# EAGLE schematic Flipdot_control (EAGLE 8.4.1)
Flip-dot Segment Controller

## Sheet 1 of 4: Connector and Row Drivers
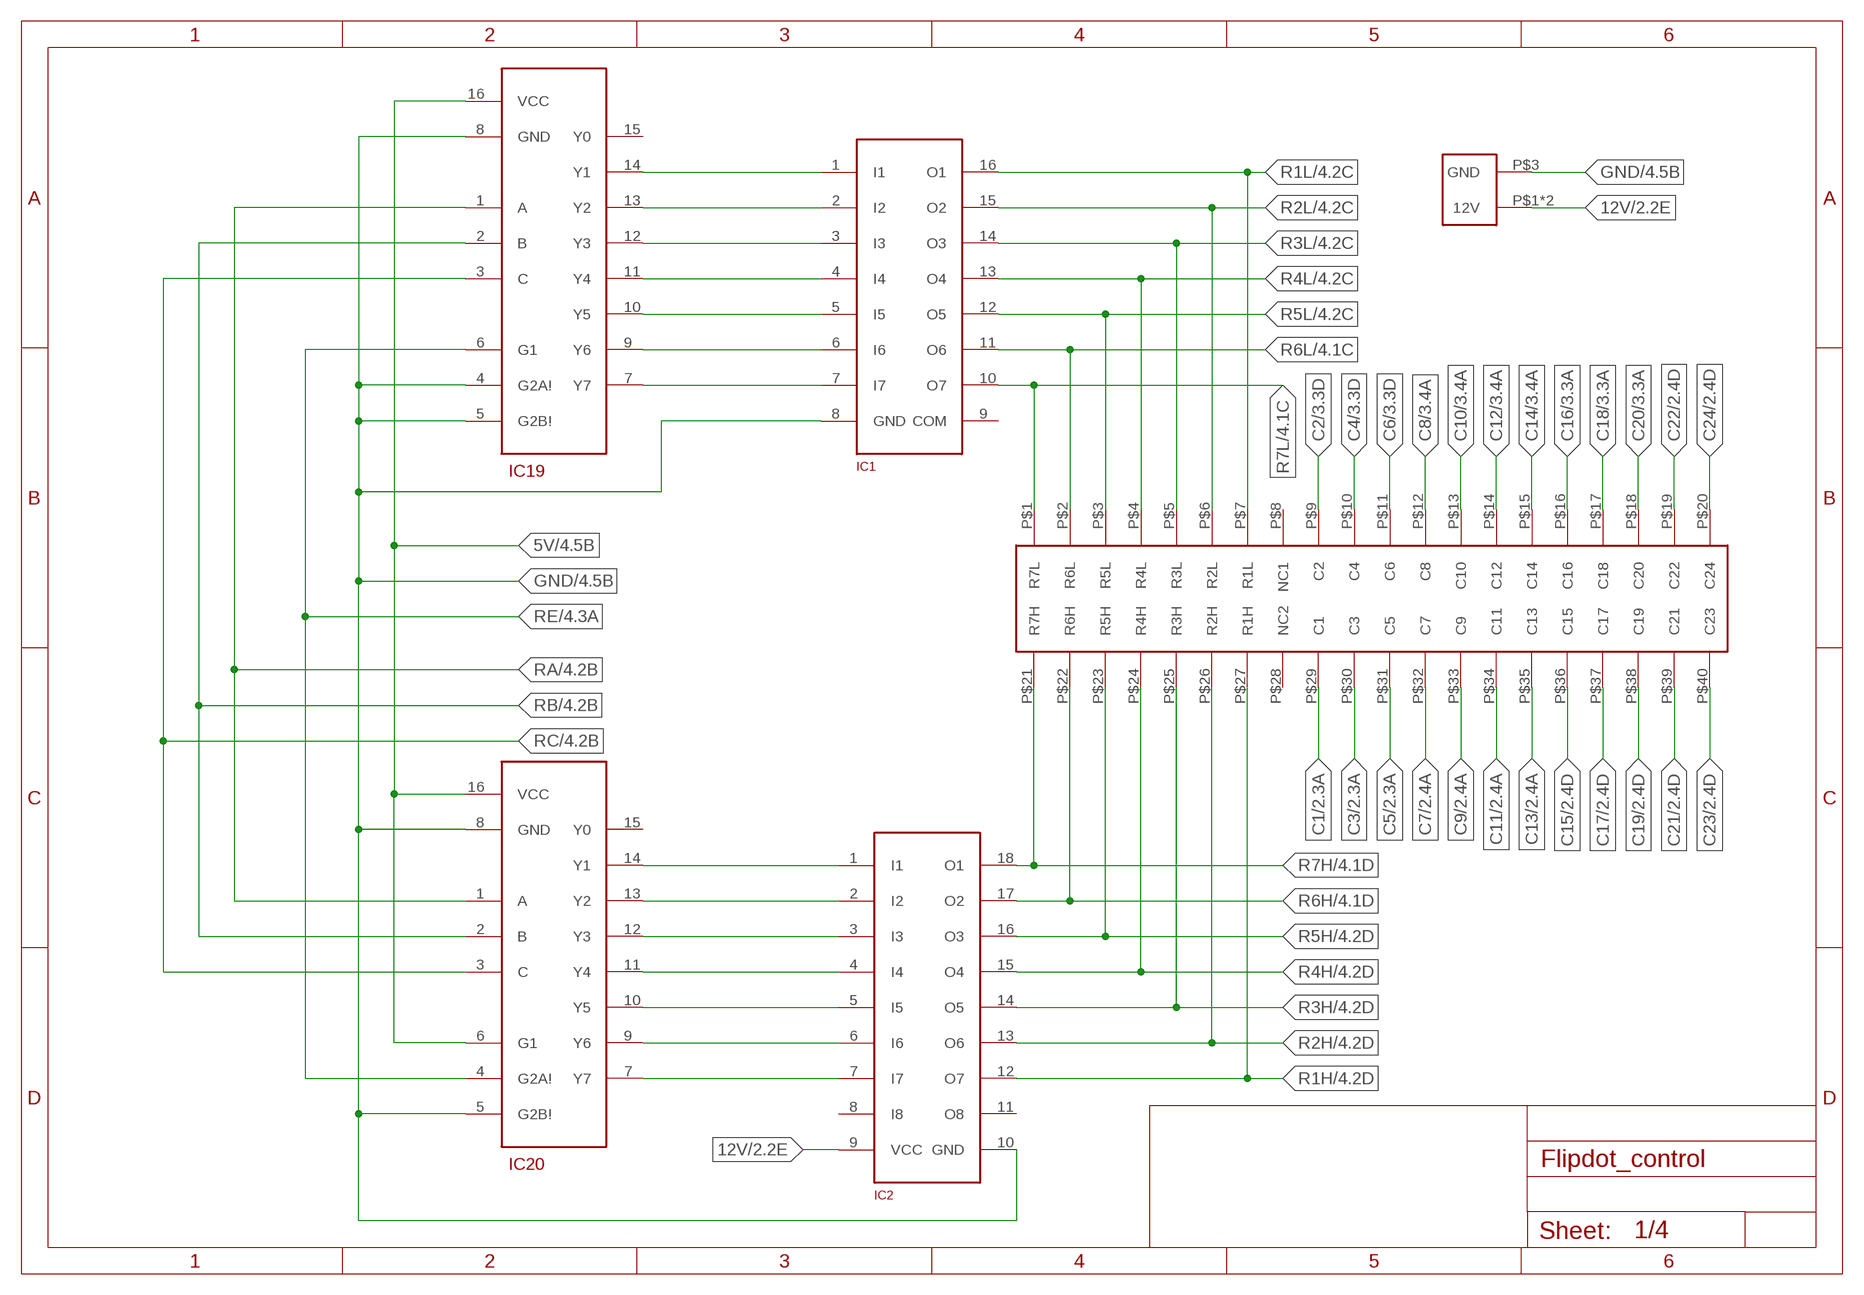
[diagram p0: schematic, sheet 1]

### Parts
IC1  ULN2003  [SO16]
IC2  TD62783_AFWG  [SO18W]
IC19  M74HC238  [SO16]
IC20  M74HC238  [SO16]
J1  HEADER_40  [HEADER_40]
U$1  PS  [PS]

### Nets
5V: IC19.16(VCC) IC20.6(G1) IC20.16(VCC) ; also sheet 2,3,4
12V: IC2.9(VCC) U$1.P$1(12V) U$1.P$2(12V) ; also sheet 2,3,4
C1: J1.P$29(C1) ; also sheet 2
C2: J1.P$9(C2) ; also sheet 3
C3: J1.P$30(C3) ; also sheet 2
C4: J1.P$10(C4) ; also sheet 3
C5: J1.P$31(C5) ; also sheet 2
C6: J1.P$11(C6) ; also sheet 3
C7: J1.P$32(C7) ; also sheet 2
C8: J1.P$12(C8) ; also sheet 3
C9: J1.P$33(C9) ; also sheet 2
C10: J1.P$13(C10) ; also sheet 3
C11: J1.P$34(C11) ; also sheet 2
C12: J1.P$14(C12) ; also sheet 3
C13: J1.P$35(C13) ; also sheet 2
C14: J1.P$15(C14) ; also sheet 3
C15: J1.P$36(C15) ; also sheet 2
C16: J1.P$16(C16) ; also sheet 3
C17: J1.P$37(C17) ; also sheet 2
C18: J1.P$17(C18) ; also sheet 3
C19: J1.P$38(C19) ; also sheet 2
C20: J1.P$18(C20) ; also sheet 3
C21: J1.P$39(C21) ; also sheet 2
C22: J1.P$19(C22) ; also sheet 2
C23: J1.P$40(C23) ; also sheet 2
C24: J1.P$20(C24) ; also sheet 2
GND: IC1.8(GND) IC2.10(GND) IC19.4(G2A!) IC19.5(G2B!) IC19.8(GND) IC20.5(G2B!) IC20.8(GND) U$1.P$3(GND) ; also sheet 2,3,4
N$15: IC1.1(I1) IC19.14(Y1)
N$16: IC1.2(I2) IC19.13(Y2)
N$17: IC1.3(I3) IC19.12(Y3)
N$18: IC1.4(I4) IC19.11(Y4)
N$19: IC1.5(I5) IC19.10(Y5)
N$20: IC1.6(I6) IC19.9(Y6)
N$21: IC1.7(I7) IC19.7(Y7)
N$24: IC2.1(I1) IC20.14(Y1)
N$25: IC2.2(I2) IC20.13(Y2)
N$26: IC2.3(I3) IC20.12(Y3)
N$27: IC2.4(I4) IC20.11(Y4)
N$28: IC2.5(I5) IC20.10(Y5)
N$29: IC2.6(I6) IC20.9(Y6)
N$30: IC2.7(I7) IC20.7(Y7)
R1H: IC2.12(O7) J1.P$27(R1H) ; also sheet 4
R1L: IC1.16(O1) J1.P$7(R1L) ; also sheet 4
R2H: IC2.13(O6) J1.P$26(R2H) ; also sheet 4
R2L: IC1.15(O2) J1.P$6(R2L) ; also sheet 4
R3H: IC2.14(O5) J1.P$25(R3H) ; also sheet 4
R3L: IC1.14(O3) J1.P$5(R3L) ; also sheet 4
R4H: IC2.15(O4) J1.P$24(R4H) ; also sheet 4
R4L: IC1.13(O4) J1.P$4(R4L) ; also sheet 4
R5H: IC2.16(O3) J1.P$23(R5H) ; also sheet 4
R5L: IC1.12(O5) J1.P$3(R5L) ; also sheet 4
R6H: IC2.17(O2) J1.P$22(R6H) ; also sheet 4
R6L: IC1.11(O6) J1.P$2(R6L) ; also sheet 4
R7H: IC2.18(O1) J1.P$21(R7H) ; also sheet 4
R7L: IC1.10(O7) J1.P$1(R7L) ; also sheet 4
RA: IC19.1(A) IC20.1(A) ; also sheet 4
RB: IC19.2(B) IC20.2(B) ; also sheet 4
RC: IC19.3(C) IC20.3(C) ; also sheet 4
RE: IC19.6(G1) IC20.4(G2A!) ; also sheet 4
Unconnected: IC1.9(COM) IC2.8(I8) IC2.11(O8) IC19.15(Y0) IC20.15(Y0) J1.P$8(NC1) J1.P$28(NC2)

## Sheet 2 of 4: Demultiplexers 1-4
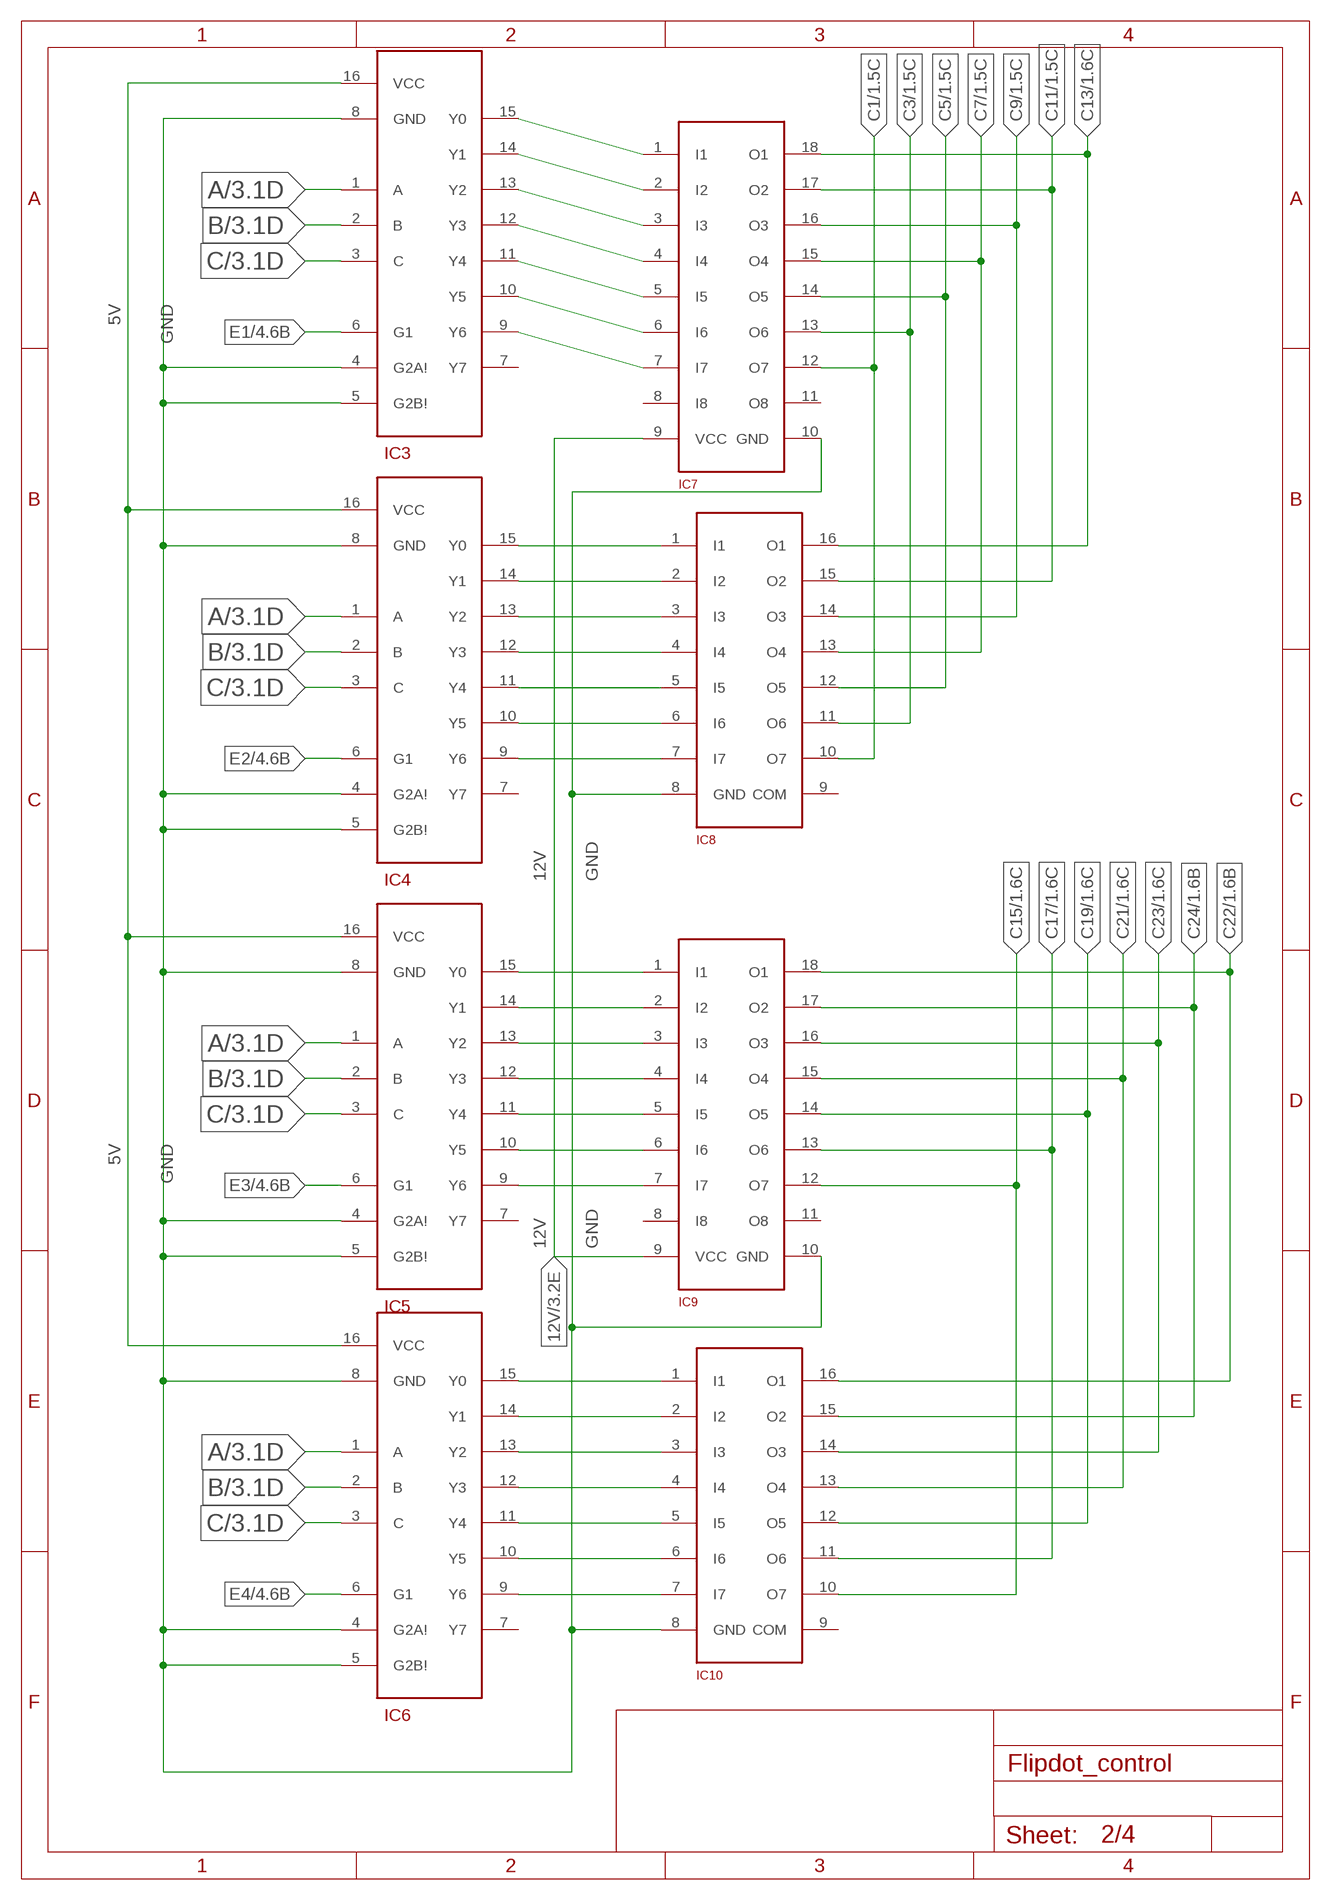
[diagram p1: schematic, sheet 2]

### Parts
IC3  M74HC238  [SO16]
IC4  M74HC238  [SO16]
IC5  M74HC238  [SO16]
IC6  M74HC238  [SO16]
IC7  TD62783_AFWG  [SO18W]
IC8  ULN2003  [SO16]
IC9  TD62783_AFWG  [SO18W]
IC10  ULN2003  [SO16]

### Nets
5V: IC3.16(VCC) IC4.16(VCC) IC5.16(VCC) IC6.16(VCC) ; also sheet 1,3,4
12V: IC7.9(VCC) IC9.9(VCC) ; also sheet 1,3,4
A: IC3.1(A) IC4.1(A) IC5.1(A) IC6.1(A) ; also sheet 3,4
B: IC3.2(B) IC4.2(B) IC5.2(B) IC6.2(B) ; also sheet 3,4
C: IC3.3(C) IC4.3(C) IC5.3(C) IC6.3(C) ; also sheet 3,4
C1: IC7.12(O7) IC8.10(O7) ; also sheet 1
C3: IC7.13(O6) IC8.11(O6) ; also sheet 1
C5: IC7.14(O5) IC8.12(O5) ; also sheet 1
C7: IC7.15(O4) IC8.13(O4) ; also sheet 1
C9: IC7.16(O3) IC8.14(O3) ; also sheet 1
C11: IC7.17(O2) IC8.15(O2) ; also sheet 1
C13: IC7.18(O1) IC8.16(O1) ; also sheet 1
C15: IC9.12(O7) IC10.10(O7) ; also sheet 1
C17: IC9.13(O6) IC10.11(O6) ; also sheet 1
C19: IC9.14(O5) IC10.12(O5) ; also sheet 1
C21: IC9.15(O4) IC10.13(O4) ; also sheet 1
C22: IC9.18(O1) IC10.16(O1) ; also sheet 1
C23: IC9.16(O3) IC10.14(O3) ; also sheet 1
C24: IC9.17(O2) IC10.15(O2) ; also sheet 1
E1: IC3.6(G1) ; also sheet 4
E2: IC4.6(G1) ; also sheet 4
E3: IC5.6(G1) ; also sheet 4
E4: IC6.6(G1) ; also sheet 4
GND: IC3.4(G2A!) IC3.5(G2B!) IC3.8(GND) IC4.4(G2A!) IC4.5(G2B!) IC4.8(GND) IC5.4(G2A!) IC5.5(G2B!) IC5.8(GND) IC6.4(G2A!) IC6.5(G2B!) IC6.8(GND) IC7.10(GND) IC8.8(GND) IC9.10(GND) IC10.8(GND) ; also sheet 1,3,4
N$83: IC3.15(Y0) IC7.1(I1)
N$84: IC3.14(Y1) IC7.2(I2)
N$85: IC3.13(Y2) IC7.3(I3)
N$86: IC3.12(Y3) IC7.4(I4)
N$87: IC3.11(Y4) IC7.5(I5)
N$88: IC3.10(Y5) IC7.6(I6)
N$89: IC3.9(Y6) IC7.7(I7)
N$90: IC4.15(Y0) IC8.1(I1)
N$91: IC4.14(Y1) IC8.2(I2)
N$92: IC4.13(Y2) IC8.3(I3)
N$93: IC4.12(Y3) IC8.4(I4)
N$94: IC4.11(Y4) IC8.5(I5)
N$95: IC4.10(Y5) IC8.6(I6)
N$96: IC4.9(Y6) IC8.7(I7)
N$97: IC5.15(Y0) IC9.1(I1)
N$98: IC5.14(Y1) IC9.2(I2)
N$99: IC5.13(Y2) IC9.3(I3)
N$100: IC5.12(Y3) IC9.4(I4)
N$101: IC5.11(Y4) IC9.5(I5)
N$102: IC5.10(Y5) IC9.6(I6)
N$103: IC5.9(Y6) IC9.7(I7)
N$104: IC6.15(Y0) IC10.1(I1)
N$105: IC6.14(Y1) IC10.2(I2)
N$106: IC6.13(Y2) IC10.3(I3)
N$107: IC6.12(Y3) IC10.4(I4)
N$108: IC6.11(Y4) IC10.5(I5)
N$109: IC6.10(Y5) IC10.6(I6)
N$110: IC6.9(Y6) IC10.7(I7)
Unconnected: IC3.7(Y7) IC4.7(Y7) IC5.7(Y7) IC6.7(Y7) IC7.8(I8) IC7.11(O8) IC8.9(COM) IC9.8(I8) IC9.11(O8) IC10.9(COM)

## Sheet 3 of 4: Demultiplexers 5-7
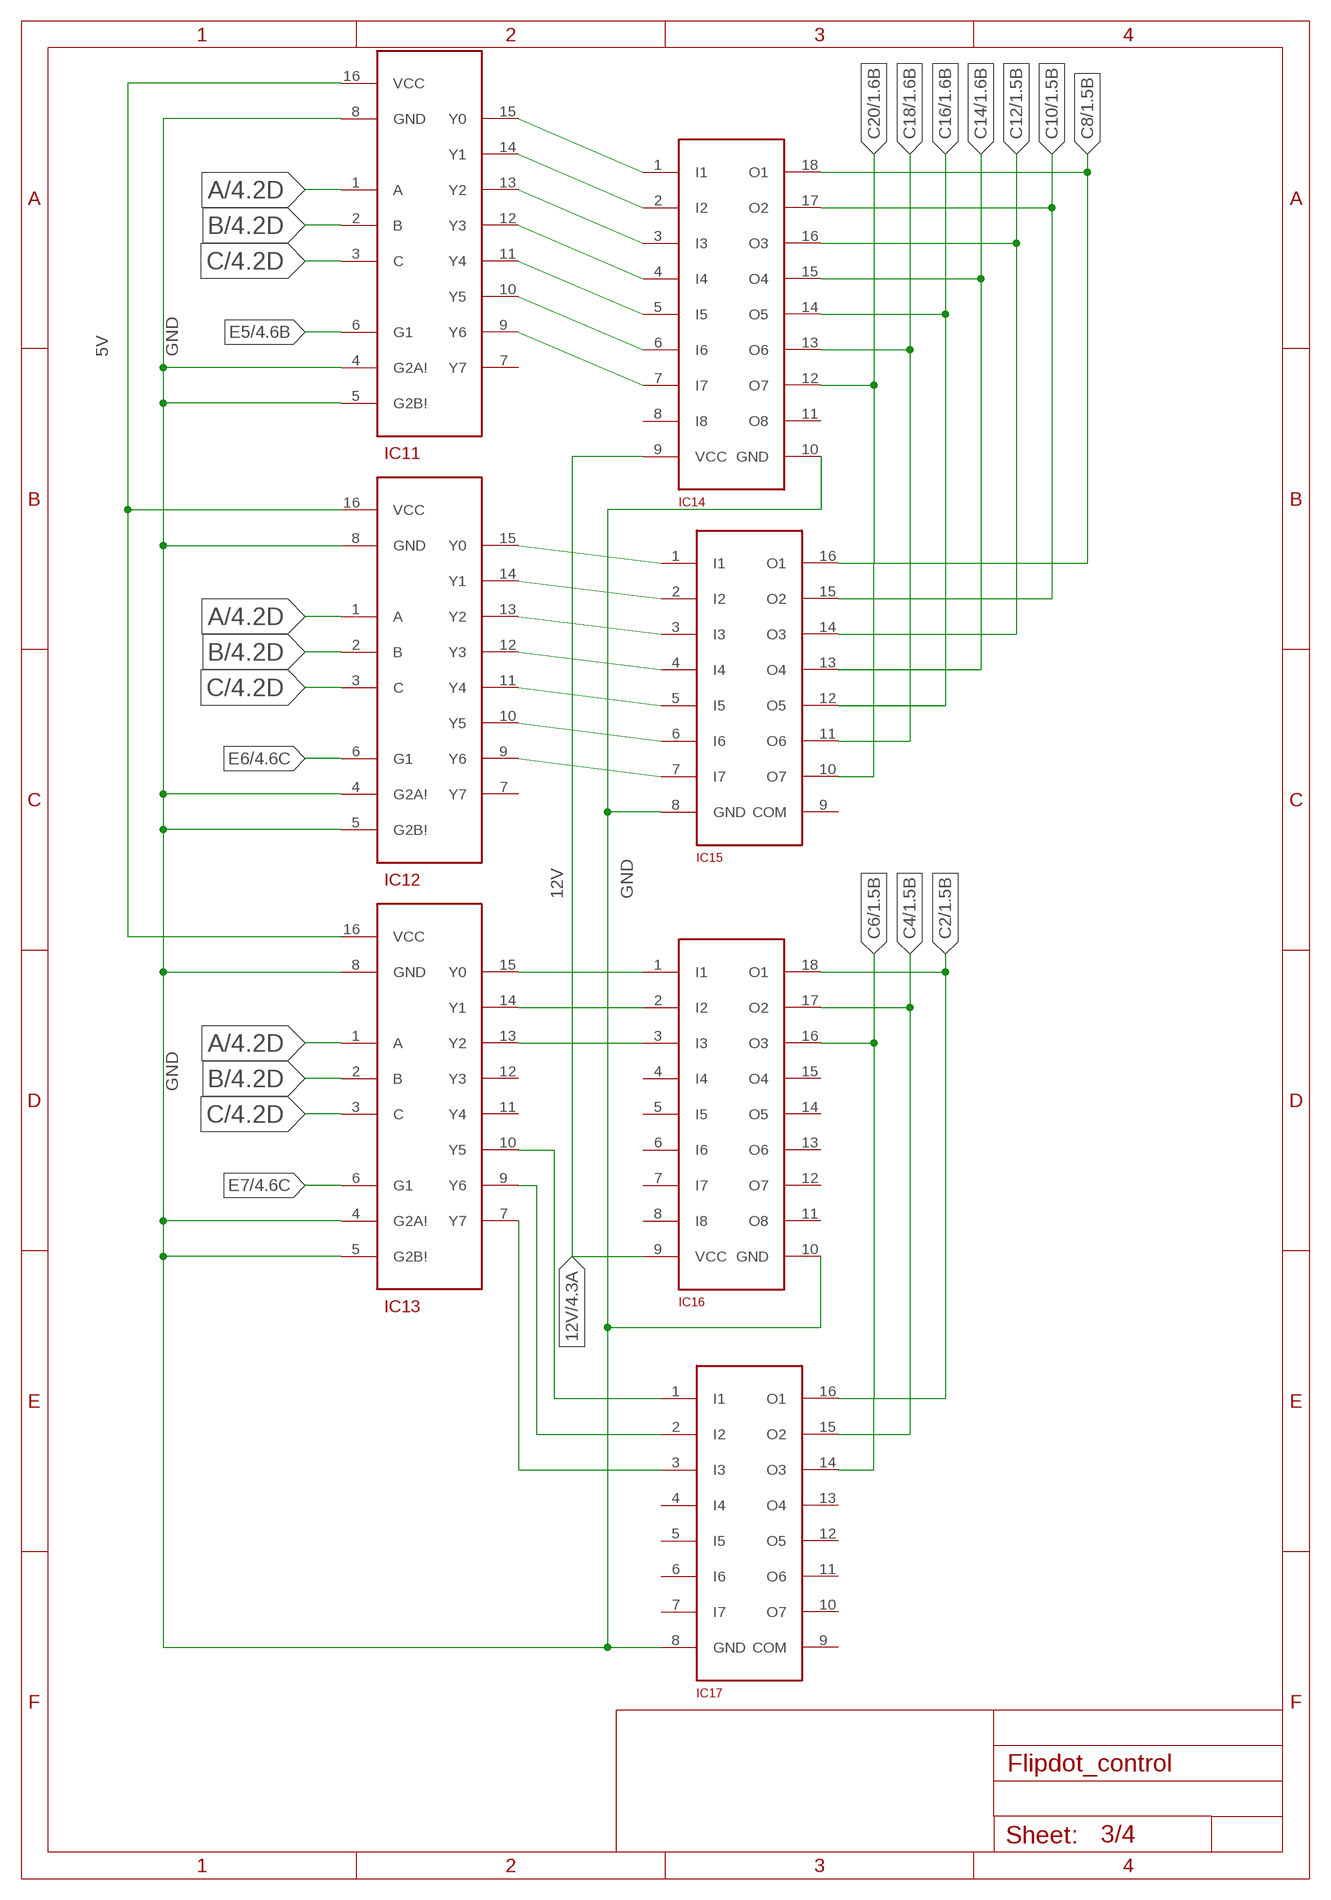
[diagram p2: schematic, sheet 3]

### Parts
IC11  M74HC238  [SO16]
IC12  M74HC238  [SO16]
IC13  M74HC238  [SO16]
IC14  TD62783_AFWG  [SO18W]
IC15  ULN2003  [SO16]
IC16  TD62783_AFWG  [SO18W]
IC17  ULN2003  [SO16]

### Nets
5V: IC11.16(VCC) IC12.16(VCC) IC13.16(VCC) ; also sheet 1,2,4
12V: IC14.9(VCC) IC16.9(VCC) ; also sheet 1,2,4
A: IC11.1(A) IC12.1(A) IC13.1(A) ; also sheet 2,4
B: IC11.2(B) IC12.2(B) IC13.2(B) ; also sheet 2,4
C: IC11.3(C) IC12.3(C) IC13.3(C) ; also sheet 2,4
C2: IC16.18(O1) IC17.16(O1) ; also sheet 1
C4: IC16.17(O2) IC17.15(O2) ; also sheet 1
C6: IC16.16(O3) IC17.14(O3) ; also sheet 1
C8: IC14.18(O1) IC15.16(O1) ; also sheet 1
C10: IC14.17(O2) IC15.15(O2) ; also sheet 1
C12: IC14.16(O3) IC15.14(O3) ; also sheet 1
C14: IC14.15(O4) IC15.13(O4) ; also sheet 1
C16: IC14.14(O5) IC15.12(O5) ; also sheet 1
C18: IC14.13(O6) IC15.11(O6) ; also sheet 1
C20: IC14.12(O7) IC15.10(O7) ; also sheet 1
E5: IC11.6(G1) ; also sheet 4
E6: IC12.6(G1) ; also sheet 4
E7: IC13.6(G1) ; also sheet 4
GND: IC11.4(G2A!) IC11.5(G2B!) IC11.8(GND) IC12.4(G2A!) IC12.5(G2B!) IC12.8(GND) IC13.4(G2A!) IC13.5(G2B!) IC13.8(GND) IC14.10(GND) IC15.8(GND) IC16.10(GND) IC17.8(GND) ; also sheet 1,2,4
N$63: IC11.15(Y0) IC14.1(I1)
N$64: IC11.14(Y1) IC14.2(I2)
N$65: IC11.13(Y2) IC14.3(I3)
N$66: IC11.12(Y3) IC14.4(I4)
N$67: IC11.11(Y4) IC14.5(I5)
N$68: IC11.10(Y5) IC14.6(I6)
N$69: IC11.9(Y6) IC14.7(I7)
N$70: IC12.15(Y0) IC15.1(I1)
N$71: IC12.14(Y1) IC15.2(I2)
N$72: IC12.13(Y2) IC15.3(I3)
N$73: IC12.12(Y3) IC15.4(I4)
N$74: IC12.11(Y4) IC15.5(I5)
N$75: IC12.10(Y5) IC15.6(I6)
N$76: IC12.9(Y6) IC15.7(I7)
N$77: IC13.15(Y0) IC16.1(I1)
N$78: IC13.14(Y1) IC16.2(I2)
N$79: IC13.13(Y2) IC16.3(I3)
N$80: IC13.10(Y5) IC17.1(I1)
N$81: IC13.9(Y6) IC17.2(I2)
N$82: IC13.7(Y7) IC17.3(I3)
Unconnected: IC11.7(Y7) IC12.7(Y7) IC13.11(Y4) IC13.12(Y3) IC14.8(I8) IC14.11(O8) IC15.9(COM) IC16.4(I4) IC16.5(I5) IC16.6(I6) IC16.7(I7) IC16.8(I8) IC16.11(O8) IC16.12(O7) IC16.13(O6) IC16.14(O5) IC16.15(O4) IC17.4(I4) IC17.5(I5) IC17.6(I6) IC17.7(I7) IC17.9(COM) IC17.10(O7) IC17.11(O6) IC17.12(O5) IC17.13(O4)

## Sheet 4 of 4: Pre-Demultiplexer
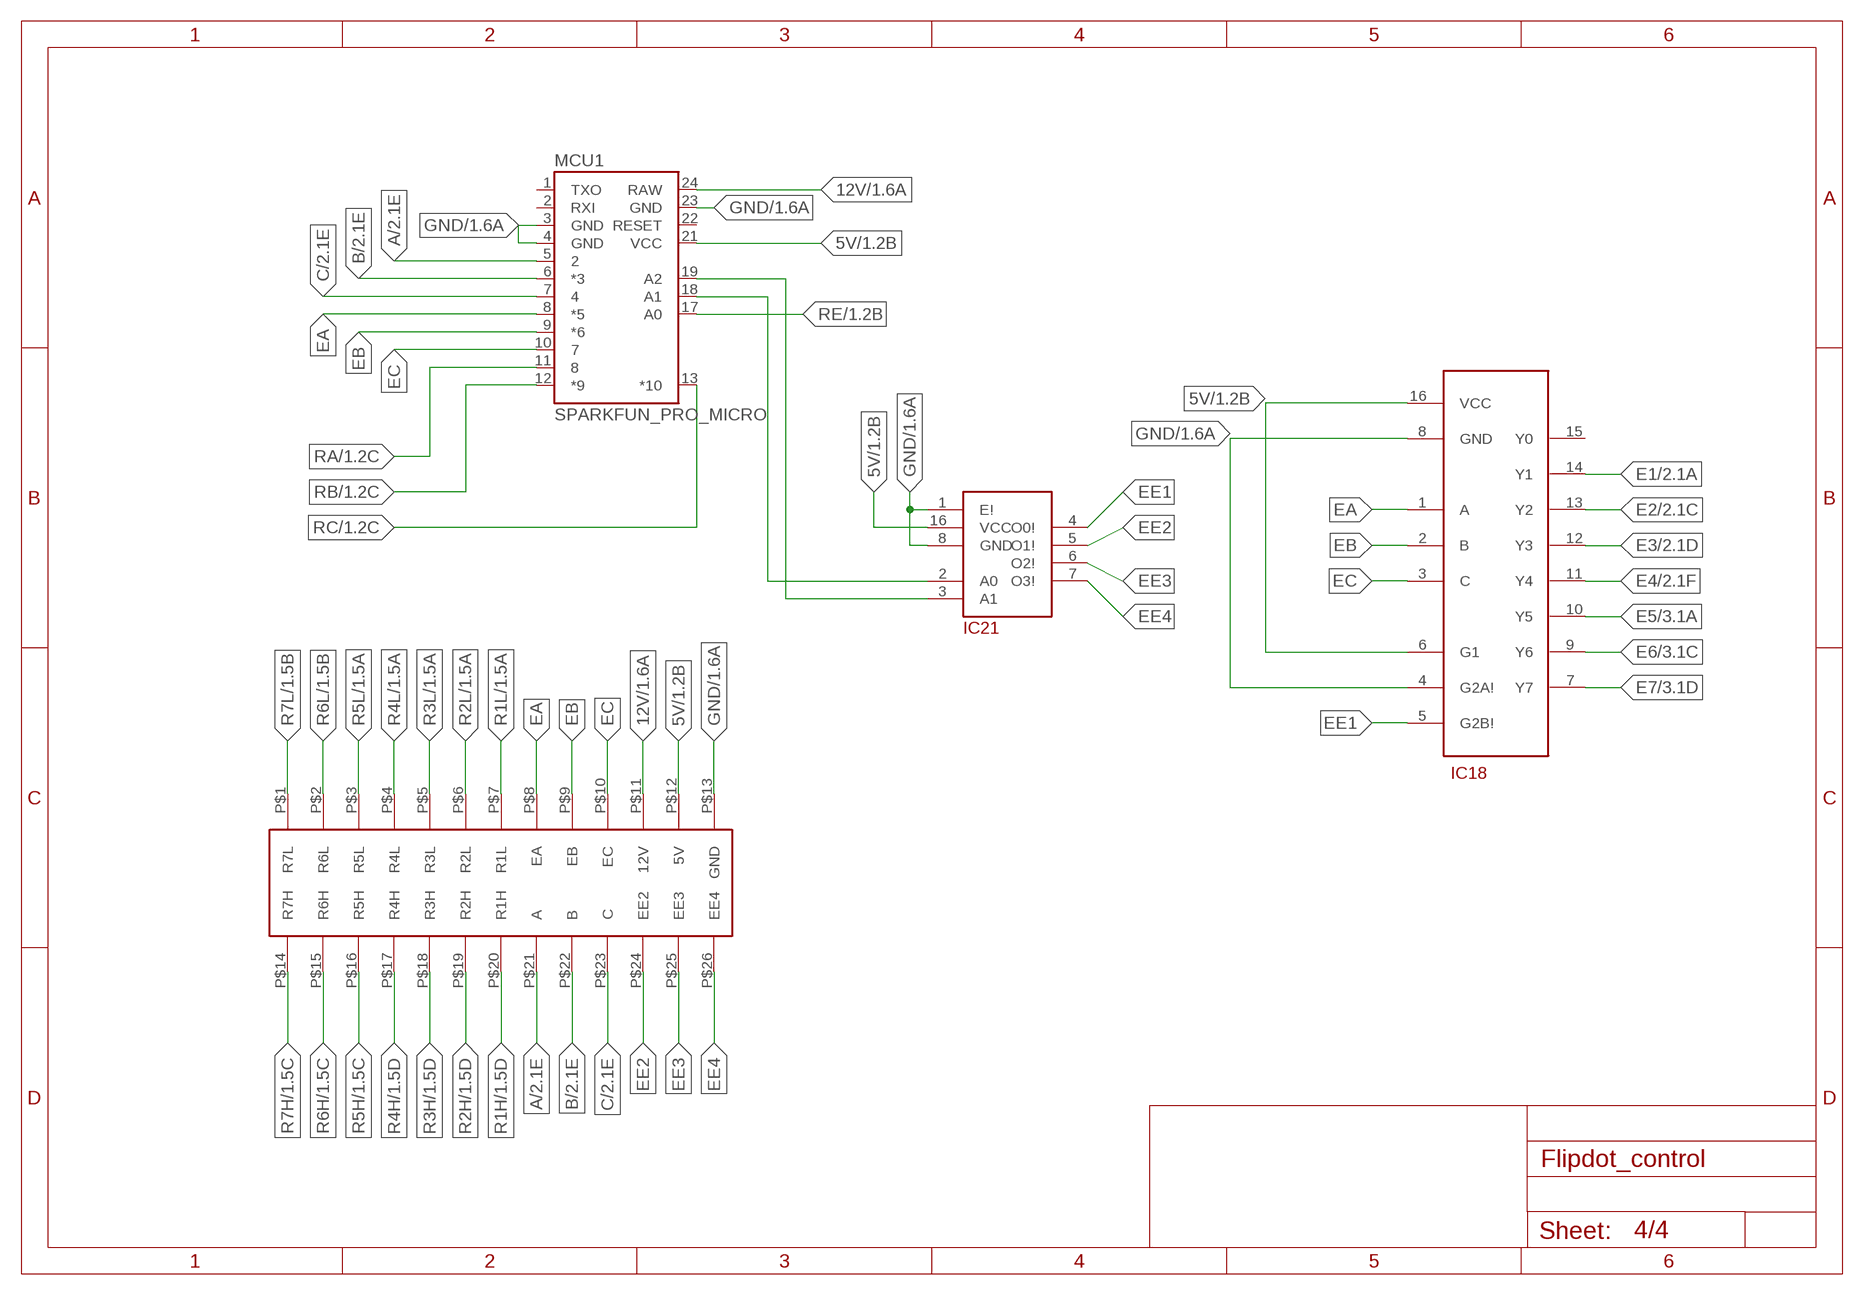
[diagram p3: schematic, sheet 4]

### Parts
IC18  M74HC238  [SO16]
IC21  74AC139SC  [SO16]
J2  HEADER_26  [HEADER_26]
MCU1  SPARKFUN_PRO_MICRO  [SPARKFUN_PRO_MICRO]

### Nets
5V: IC18.6(G1) IC18.16(VCC) IC21.16(VCC) J2.P$12(5V) MCU1.21(VCC) ; also sheet 1,2,3
12V: J2.P$11(12V) MCU1.24(RAW) ; also sheet 1,2,3
A: J2.P$21(A) MCU1.5 ; also sheet 2,3
B: J2.P$22(B) MCU1.6(*3) ; also sheet 2,3
C: J2.P$23(C) MCU1.7 ; also sheet 2,3
E1: IC18.14(Y1) ; also sheet 2
E2: IC18.13(Y2) ; also sheet 2
E3: IC18.12(Y3) ; also sheet 2
E4: IC18.11(Y4) ; also sheet 2
E5: IC18.10(Y5) ; also sheet 3
E6: IC18.9(Y6) ; also sheet 3
E7: IC18.7(Y7) ; also sheet 3
EA: IC18.1(A) J2.P$8(EA) MCU1.8(*5)
EB: IC18.2(B) J2.P$9(EB) MCU1.9(*6)
EC: IC18.3(C) J2.P$10(EC) MCU1.10
EE1: IC18.5(G2B!) IC21.4(O0!)
EE2: IC21.5(O1!) J2.P$24(EE2)
EE3: IC21.6(O2!) J2.P$25(EE3)
EE4: IC21.7(O3!) J2.P$26(EE4)
GND: IC18.4(G2A!) IC18.8(GND) IC21.1(E!) IC21.8(GND) J2.P$13(GND) MCU1.3(GND) MCU1.4(GND) MCU1.23(GND) ; also sheet 1,2,3
N$1: IC21.2(A0) MCU1.18(A1)
N$2: IC21.3(A1) MCU1.19(A2)
R1H: J2.P$20(R1H) ; also sheet 1
R1L: J2.P$7(R1L) ; also sheet 1
R2H: J2.P$19(R2H) ; also sheet 1
R2L: J2.P$6(R2L) ; also sheet 1
R3H: J2.P$18(R3H) ; also sheet 1
R3L: J2.P$5(R3L) ; also sheet 1
R4H: J2.P$17(R4H) ; also sheet 1
R4L: J2.P$4(R4L) ; also sheet 1
R5H: J2.P$16(R5H) ; also sheet 1
R5L: J2.P$3(R5L) ; also sheet 1
R6H: J2.P$15(R6H) ; also sheet 1
R6L: J2.P$2(R6L) ; also sheet 1
R7H: J2.P$14(R7H) ; also sheet 1
R7L: J2.P$1(R7L) ; also sheet 1
RA: MCU1.11 ; also sheet 1
RB: MCU1.12(*9) ; also sheet 1
RC: MCU1.13(*10) ; also sheet 1
RE: MCU1.17(A0) ; also sheet 1
Unconnected: IC18.15(Y0) MCU1.1(TXO) MCU1.2(RXI) MCU1.22(RESET)

## Library data of the parts
IC1 IC8 IC10 IC15 IC17 = Flipdot:ULN2003: Darlington Transistor [GND]
IC2 IC7 IC9 IC14 IC16 = Flipdot:TD62783_AFWG: Darlington Source Array [V]
IC3-IC6 IC11-IC13 IC18-IC20 = Flipdot:M74HC238: 3 To 8 Line Decoder
IC21 = Flipdot:74AC139SC: 2-4 Line Decoder
J1 = Flipdot:HEADER_40
J2 = Flipdot:HEADER_26
MCU1 = Flipdot:SPARKFUN_PRO_MICRO: SparkFun Pro Micro Atmega32U4 compatible footprint. SparkFun Products: 3.3V/8MHz <https://www.sparkfun.com/products/12587> 5V/16MHz <https://www.sparkfun.com/products/12640>
U$1 = Flipdot:PS